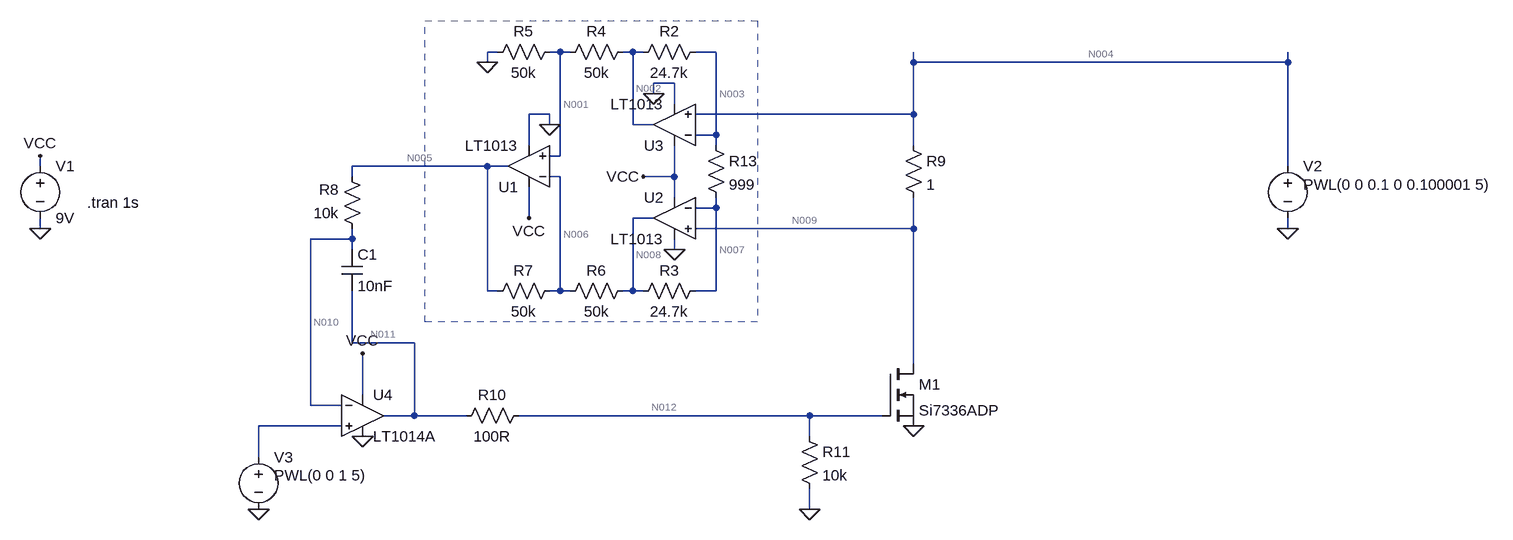
[diagram p0: schematic INA_001.asc]
INA_001.asc, the LTspice schematic file:
Version 4
SHEET 1 1540 756
WIRE -32 32 -48 32
WIRE 64 32 48 32
WIRE 80 32 64 32
WIRE 176 32 160 32
WIRE 192 32 176 32
WIRE 304 32 272 32
WIRE -48 48 -48 32
WIRE 608 48 608 32
WIRE 1184 48 1184 32
WIRE 1184 48 608 48
WIRE 240 80 208 80
WIRE 208 96 208 80
WIRE 240 112 240 80
WIRE 48 128 16 128
WIRE 608 128 608 48
WIRE 608 128 272 128
WIRE 48 144 48 128
WIRE 176 144 176 32
WIRE 208 144 176 144
WIRE 304 160 304 32
WIRE 304 160 272 160
WIRE 16 176 16 128
WIRE 304 176 304 160
WIRE 608 176 608 128
WIRE 64 192 64 32
WIRE 64 192 48 192
WIRE -736 208 -736 192
WIRE -48 208 -256 208
WIRE -16 208 -48 208
WIRE 1184 208 1184 48
WIRE -256 224 -256 208
WIRE 64 224 48 224
WIRE 240 224 240 176
WIRE 240 224 192 224
WIRE 240 256 240 224
WIRE 304 272 304 256
WIRE 304 272 272 272
WIRE 16 288 16 240
WIRE 208 288 176 288
WIRE -736 304 -736 288
WIRE 608 304 608 256
WIRE 608 304 272 304
WIRE 1184 304 1184 288
WIRE -256 320 -256 304
WIRE -256 320 -320 320
WIRE -256 336 -256 320
WIRE 240 336 240 320
WIRE -48 400 -48 208
WIRE -32 400 -48 400
WIRE 64 400 64 224
WIRE 64 400 48 400
WIRE 80 400 64 400
WIRE 176 400 176 288
WIRE 176 400 160 400
WIRE 192 400 176 400
WIRE 304 400 304 272
WIRE 304 400 272 400
WIRE -256 480 -256 400
WIRE -160 480 -256 480
WIRE 608 512 608 304
WIRE -240 560 -240 496
WIRE -320 576 -320 320
WIRE -272 576 -320 576
WIRE -160 592 -160 480
WIRE -160 592 -208 592
WIRE -80 592 -160 592
WIRE 448 592 0 592
WIRE 560 592 448 592
WIRE -272 608 -400 608
WIRE 448 624 448 592
WIRE -400 656 -400 608
WIRE 448 736 448 704
FLAG 208 96 0
FLAG 240 336 0
FLAG 1184 304 0
FLAG 192 224 VCC
FLAG 16 288 VCC
FLAG -736 304 0
FLAG -736 192 VCC
FLAG -48 48 0
FLAG 48 144 0
FLAG -240 624 0
FLAG -240 496 VCC
FLAG -400 736 0
FLAG 608 608 0
FLAG 448 736 0
SYMBOL res 288 16 R90
WINDOW 0 0 56 VBottom 2
WINDOW 3 32 56 VTop 2
SYMATTR InstName R2
SYMATTR Value 24.7k
SYMBOL res 288 384 R90
WINDOW 0 0 56 VBottom 2
WINDOW 3 32 56 VTop 2
SYMATTR InstName R3
SYMATTR Value 24.7k
SYMBOL res 176 16 R90
WINDOW 0 0 56 VBottom 2
WINDOW 3 32 56 VTop 2
SYMATTR InstName R4
SYMATTR Value 50k
SYMBOL res 64 16 R90
WINDOW 0 0 56 VBottom 2
WINDOW 3 32 56 VTop 2
SYMATTR InstName R5
SYMATTR Value 50k
SYMBOL res 176 384 R90
WINDOW 0 0 56 VBottom 2
WINDOW 3 32 56 VTop 2
SYMATTR InstName R6
SYMATTR Value 50k
SYMBOL res 64 384 R90
WINDOW 0 0 56 VBottom 2
WINDOW 3 32 56 VTop 2
SYMATTR InstName R7
SYMATTR Value 50k
SYMBOL voltage -736 192 R0
WINDOW 123 0 0 Left 0
WINDOW 39 0 0 Left 0
SYMATTR InstName V1
SYMATTR Value 9V
SYMBOL voltage 1184 192 R0
WINDOW 123 0 0 Left 0
WINDOW 39 0 0 Left 0
WINDOW 3 24 44 Left 2
SYMATTR Value PWL(0 0 0.1 0 0.100001 5)
SYMATTR InstName V2
SYMBOL res 592 160 R0
SYMATTR InstName R9
SYMATTR Value 1
SYMBOL res -240 320 R180
WINDOW 0 36 76 Left 2
WINDOW 3 36 40 Left 2
SYMATTR InstName R8
SYMATTR Value 10k
SYMBOL cap -272 336 R0
SYMATTR InstName C1
SYMATTR Value 10nF
SYMBOL Opamps\\LT1014A -240 528 R0
SYMATTR InstName U4
SYMBOL voltage -400 640 R0
WINDOW 3 24 44 Left 2
WINDOW 123 0 0 Left 0
WINDOW 39 0 0 Left 0
SYMATTR Value PWL(0 0 1 5)
SYMATTR InstName V3
SYMBOL res 16 576 R90
WINDOW 0 0 56 VBottom 2
WINDOW 3 32 56 VTop 2
SYMATTR InstName R10
SYMATTR Value 100R
SYMBOL nmos 560 512 R0
SYMATTR InstName M1
SYMATTR Value Si7336ADP
SYMBOL res 432 608 R0
SYMATTR InstName R11
SYMATTR Value 10k
SYMBOL res 288 160 R0
SYMATTR InstName R13
SYMATTR Value 999
SYMBOL Opamps\\LT1013 16 272 R180
SYMATTR InstName U1
SYMBOL Opamps\\LT1013 240 224 M0
SYMATTR InstName U2
SYMBOL Opamps\\LT1013 240 208 R180
SYMATTR InstName U3
TEXT -664 264 Left 2 !.tran 1s
LINE Normal 368 448 -144 448 2
LINE Normal 368 -16 368 448 2
LINE Normal -144 -16 368 -16 2
LINE Normal -144 448 -144 -16 2
LINE Normal -144 448 -144 448 2
LINE Normal -144 448 -144 448 2

The netlist it stands for:
* INA_001.asc
R2 N003 N002 24.7k
R3 N007 N008 24.7k
R4 N002 N001 50k
R5 N001 0 50k
R6 N008 N006 50k
R7 N006 N005 50k
V1 VCC 0 9V
V2 N004 0 PWL(0 0 0.1 0 0.100001 5)
R9 N004 N009 1
R8 N010 N005 10k
C1 N010 N011 10nF
XU4 N013 N010 VCC 0 N011 LT1014A  ; pins In+ In- V+ V- OUT
V3 N013 0 PWL(0 0 1 5)
R10 N012 N011 100R
M1 N009 N012 0 0 Si7336ADP
R11 N012 0 10k
R13 N003 N007 999
XU1 N001 N006 VCC 0 N005 LT1013  ; pins In+ In- V+ V- OUT
XU2 N009 N007 VCC 0 N008 LT1013  ; pins In+ In- V+ V- OUT
XU3 N004 N003 VCC 0 N002 LT1013  ; pins In+ In- V+ V- OUT
.model NMOS NMOS
.model PMOS PMOS
.lib standard.mos
.tran 1s
.lib LTC.lib
.backanno
.end

* Results of the author's LTspice run, read from the files saved beside the schematic
* Operating Point, zero values left out:
*   V(n003) = 33.54 mV
*   V(n002) = 33.22 mV
*   V(n007) = 33.54 mV
*   V(n008) = 33.25 mV
*   V(n001) = 16.92 mV
*   V(n006) = 38.77 mV
*   V(n005) = 43.66 mV
*   V(vcc) = 9 V
*   V(n009) = 12.53 nV
*   V(n010) = 43.79 mV
*   V(n011) = 27.19 mV
*   V(n012) = 26.92 mV
*   I(R13) = -608.4 pA
*   I(R11) = 2.692 µA
*   I(R10) = -2.692 µA
*   I(R8) = 12.35 nA
*   I(R9) = -12.53 nA
*   I(R7) = -97.91 nA
*   I(R6) = -110.3 nA
*   I(R5) = 338.5 nA
*   I(R4) = 326 nA
*   I(R3) = 11.76 nA
*   I(R2) = 12.98 nA
*   I(V3) = 12.55 nA
*   I(V2) = 25.06 nA
*   I(V1) = -955.8 µA
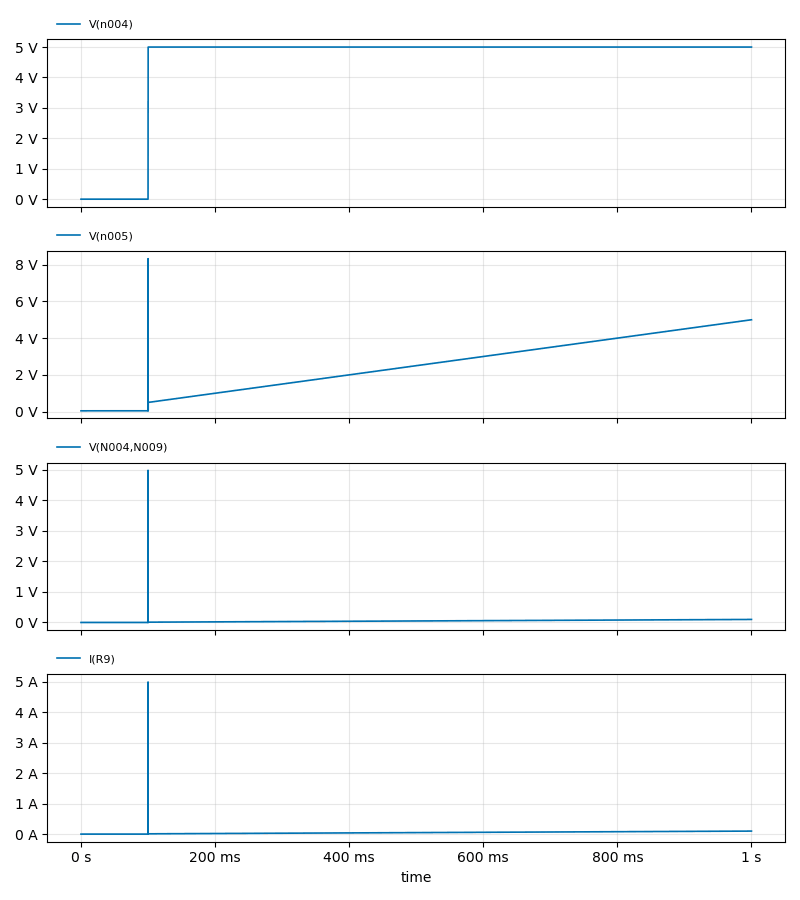
[diagram p1: Transient Analysis of INA_001.asc, plotted from the saved traces]
* Transient Analysis, 1 run:
*   V(n004): min 0 V, max 5 V, average 4.5 V, rms 4.743 V, last 5 V
*   V(n005): min 43.66 mV, max 8.324 V, average 2.48 V, rms 2.936 V, last 5 V
*   V(N004,N009): min -1.431 µV, max 4.988 V, average 49.5 mV, rms 74.39 mV, last 99.12 mV
*   I(R9): min -1.416 µA, max 4.988 A, average 49.5 mA, rms 74.39 mA, last 99.12 mA